# EAGLE schematic LTC4063-TestBoard (EAGLE 6.3)
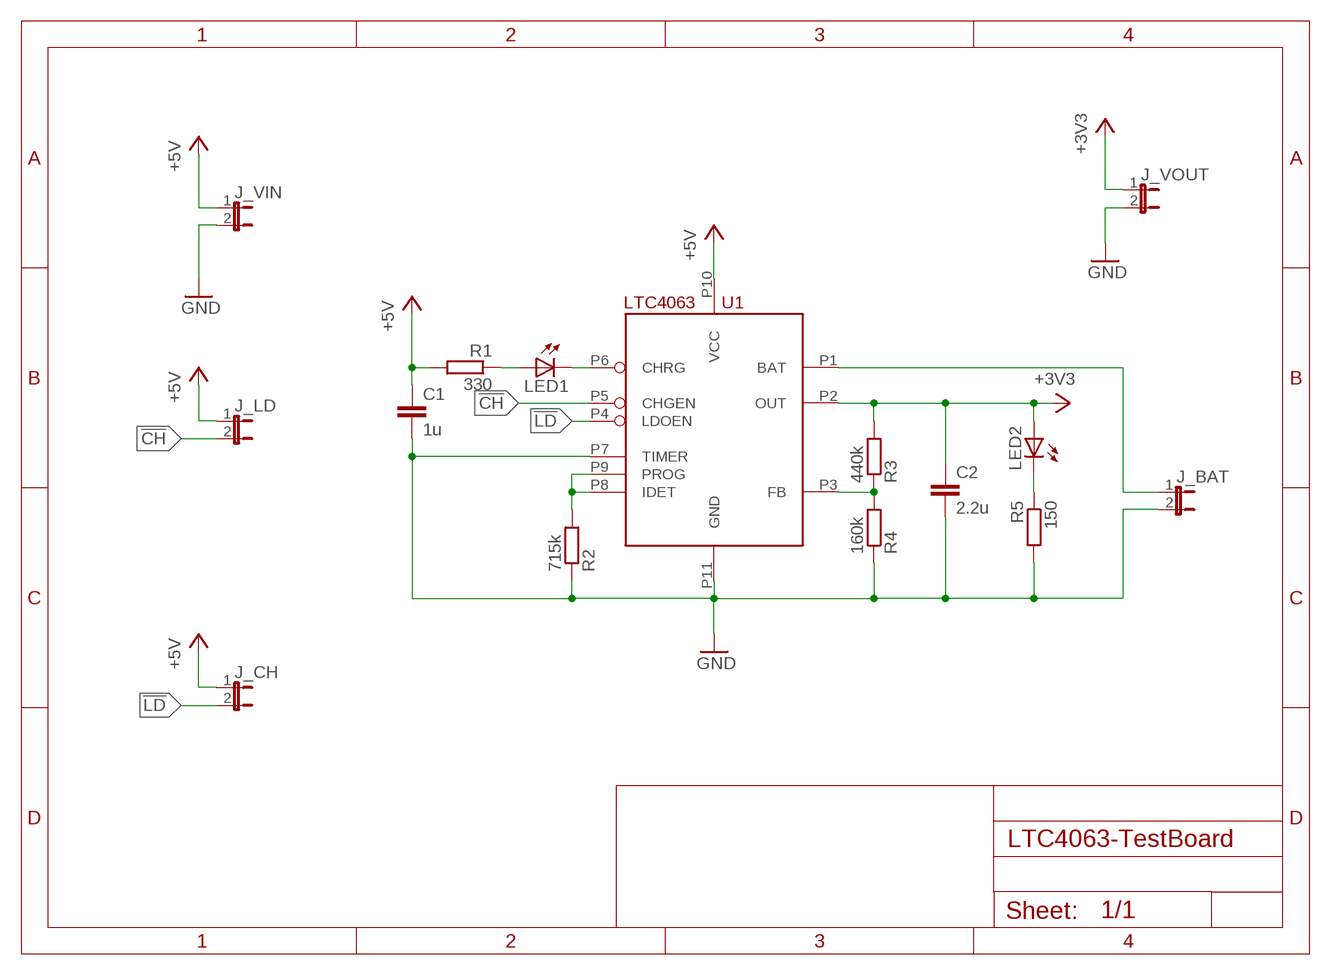
[diagram p0: schematic, sheet 1]

## Parts
C1  1u  C-EUC0805K  [C0805K]
C2  2.2u  C-EUC0805K  [C0805K]
J_BAT  JP1E  [JP1]
J_CH  JP1E  [JP1]
J_LD  JP1E  [JP1]
J_VIN  JP1E  [JP1]
J_VOUT  JP1E  [JP1]
LED1  LED3MM  [LED3MM]
LED2  LED3MM  [LED3MM]
R1  330  R-EU_R0805  [R0805]
R2  715k  R-EU_R0805  [R0805]
R3  440k  R-EU_R0805  [R0805]
R4  160k  R-EU_R0805  [R0805]
R5  150  R-EU_R0805  [R0805]
U1  LTC4063  [LTC4063]

## Nets
!CH: J_LD.2 U1.P5(CHGEN)
!LD: J_CH.2 U1.P4(LDOEN)
+3V3: C2.1 J_VOUT.1 LED2.A R3.2 U1.P2(OUT)
+5V: C1.1 J_CH.1 J_LD.1 J_VIN.1 R1.2 U1.P10(VCC)
GND: C1.2 C2.2 J_BAT.2 J_VIN.2 J_VOUT.2 R2.1 R4.1 R5.2 U1.P7(TIMER) U1.P11(GND)
N$1: R3.1 R4.2 U1.P3(FB)
N$2: J_BAT.1 U1.P1(BAT)
N$3: LED1.K(C) U1.P6(CHRG)
N$4: LED1.A R1.1
N$5: R2.2 U1.P8(IDET) U1.P9(PROG)
N$6: LED2.K(C) R5.1

## Library data of the parts
C1 C2 = rcl:C-EU: CAPACITOR, European symbol
J_BAT J_CH J_LD J_VIN J_VOUT = jumper:JP1E: JUMPER
LED1 LED2 = led:LED: LED OSRAM: - CHIPLED LG R971, LG N971, LY N971, LG Q971, LY Q971, LO R971, LY R971 LH N974, LH R974 LS Q976, LO Q976, LY Q976 LO Q996 - Hyper CHIPLED LW Q18S LB Q993, LB Q99A, LB R99A - SideLED LS A670, LO A670, LY A670, LG A670, LP A670 LB A673, LV A673, LT A673, LW A673 LH A674 LY A675 LS A676, LA A676, LO A676, LY A676, LW A676 LS A679, LY A679, LG A679 - Hyper Micro SIDELED® LS Y876, LA Y876, LO Y876, LY Y876 LT Y87S - SmartLED LW L88C, LW L88S LB L89C, LB L89S, LG L890 LS L89K, LO L89K, LY L89K LS L896, LA L896, LO L896, LY L896 - TOPLED LS T670, LO T670, LY T670, LG T670, LP T670 LSG T670, LSP T670, LSY T670, LOP T670, LYG T670 LG T671, LOG T671, LSG T671 LB T673, LV T673, LT T673, LW T673 LH T674 LS T676, LA T676, LO T676, LY T676, LB T676, LH T676, LSB T676, LW T676 LB T67C, LV T67C, LT T67C, LS T67K, LO T67K, LY T67K, LW E67C LS E67B, LA E67B, LO E67B, LY E67B, LB E67C, LV E67C, LT E67C LW T67C LS T679, LY T679, LG T679 LS T770, LO T770, LY T770, LG T770, LP T770 LB T773, LV T773, LT T773, LW T773 LH T774 LS E675, LA E675, LY E675, LS T675 LS T776, LA T776, LO T776, LY T776, LB T776 LHGB T686 LT T68C, LB T68C - Hyper Mini TOPLED® LB M676 - Mini TOPLED Santana® LG M470 LS M47K, LO M47K, LY M47K Source: http://www.osram.convergy.de LUXEON: - LUMILED® LXK2-PW12-R00, LXK2-PW12-S00, LXK2-PW14-U00, LXK2-PW14-V00 LXK2-PM12-R00, LXK2-PM12-S00, LXK2-PM14-U00 LXK2-PE12-Q00, LXK2-PE12-R00, LXK2-PE12-S00, LXK2-PE14-T00, LXK2-PE14-U00 LXK2-PB12-K00, LXK2-PB12-L00, LXK2-PB12-M00, LXK2-PB14-N00, LXK2-PB14-P00, LXK2-PB14-Q00 LXK2-PR12-L00, LXK2-PR12-M00, LXK2-PR14-Q00, LXK2-PR14-R00 LXK2-PD12-Q00, LXK2-PD12-R00, LXK2-PD12-S00 LXK2-PH12-R00, LXK2-PH12-S00 LXK2-PL12-P00, LXK2-PL12-Q00, LXK2-PL12-R00 Source: www.luxeon.com KINGBRIGHT: KA-3528ASYC Source: www.kingbright.com
R1-R5 = rcl:R-EU_: RESISTOR, European symbol
U1 = LinearTechnology:LTC4063: LTC4063 - Standalone Linear Li-Ion Charger with Micropower Low Dropout Linear Regulator The LTC®4063 is a standalone linear charger for single cell lithium-ion batteries with an adjustable low dropout linear regulator (LDO). The adjustable LDO regulates an output voltage between 1.2V to 4.2V at up to 100mA load cur- rent. When the input supply (wall adapter or USB supply) is removed, the LDO regulates the output voltage without interruption. The battery charger and LDO regulator can be enabled individually. No external sense resistor or external blocking diode is required for charging due to the internal MOSFET archi- tecture. For more details have a look at the data sheet <http://cds.linear.com/docs/en/datasheet/4063fc.pdf>. Copyright (c) 2013, Michael Hohl <http://www.michaelhohl.net>